# Altium schematic sheet P20_WIFI&BT_SDIO_IO EXPANDERS.SchDoc
size 420 x 297 mm
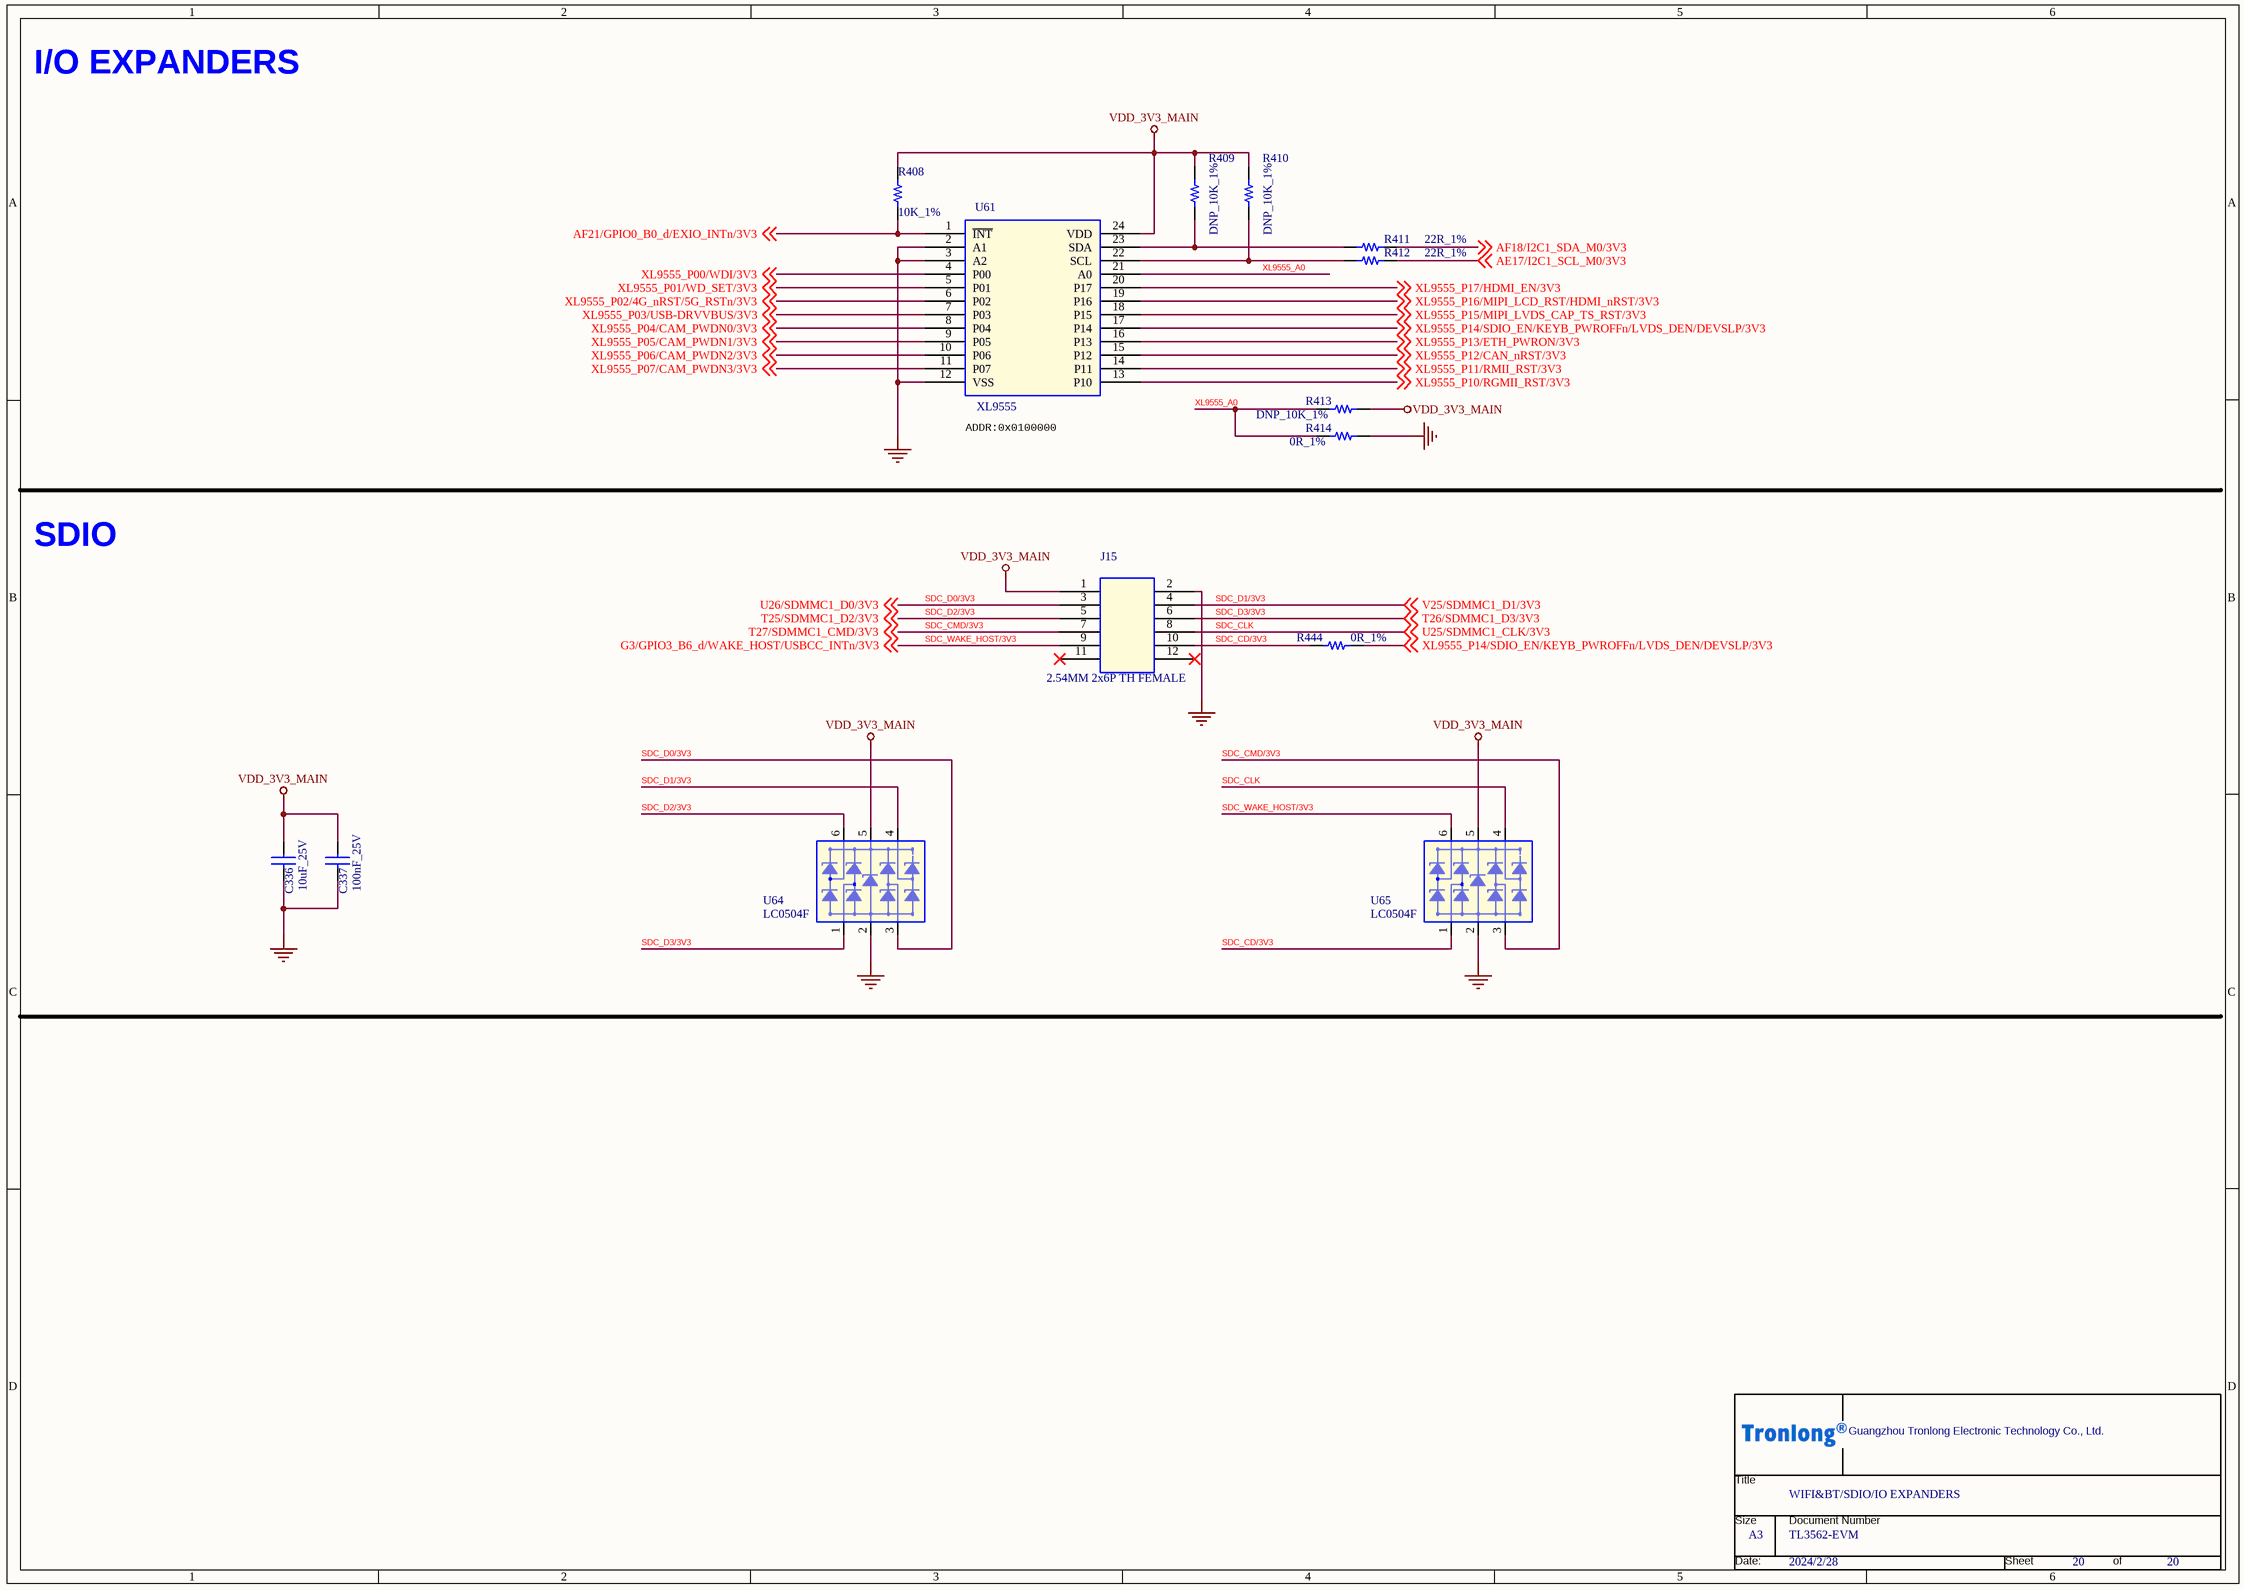
[diagram p0: P20_WIFI&BT_SDIO_IO EXPANDERS.SchDoc]

## Parts
*  Page Count: 20  Page Size: A3  OrgName: Guangzhou Tronlong Electronic Technology Co., Ltd.  Title: WIFI&BT/SDIO/IO EXPANDERS  Doc: TL3562-EVM  Page Modify Date: 2024/2/28  (hidden comment: Tronlong_TITTLE_20211115)  (graphical)
C336  10uF_25V  [C0603]
C337  100nF_25V  [C0402]
J15  2.54MM 2x6P TH FEMALE  [header_2x6_2d54_male]
R408  10K_1%  [R0402]
R409  DNP_10K_1%  [R0402]
R410  DNP_10K_1%  [R0402]
R411  22R_1%  [R0402]
R412  22R_1%  [R0402]
R413  DNP_10K_1%  [R0402]
R414  0R_1%  [R0603]
R444  0R_1%  [R0402]
U61  XL9555  [TSSOP24]
U64  LC0504F  [SOT363]
U65  LC0504F  [SOT363]

## Nets
GND: C336.2 C337.2 J15.2 R414.2 U61.2(A1) U61.3(A2) U61.12(VSS) U64.2 U65.2
VDD_3V3_MAIN: C336.1 C337.1 J15.1 R408.1 R409.1 R410.1 R413.1 U61.24(VDD) U64.5 U65.5
AE17/I2C1_SCL_M0/3V3: R412.1 ; off-sheet AE17/I2C1_SCL_M0/3V3
AF18/I2C1_SDA_M0/3V3: R411.1 ; off-sheet AF18/I2C1_SDA_M0/3V3
AF21/GPIO0_B0_d/EXIO_INTn/3V3: R408.2 U61.1(~{INT}) ; off-sheet AF21/GPIO0_B0_d/EXIO_INTn/3V3
SDC_CD/3V3: J15.10 R444.2 U65.1
SDC_CLK: J15.8 U65.4 ; off-sheet U25/SDMMC1_CLK/3V3  [also labelled U25/SDMMC1_CLK/3V3]
SDC_CMD/3V3: J15.7 U65.3 ; off-sheet T27/SDMMC1_CMD/3V3  [also labelled T27/SDMMC1_CMD/3V3]
SDC_D0/3V3: J15.3 U64.3 ; off-sheet U26/SDMMC1_D0/3V3  [also labelled U26/SDMMC1_D0/3V3]
SDC_D1/3V3: J15.4 U64.4 ; off-sheet V25/SDMMC1_D1/3V3  [also labelled V25/SDMMC1_D1/3V3]
SDC_D2/3V3: J15.5 U64.6 ; off-sheet T25/SDMMC1_D2/3V3  [also labelled T25/SDMMC1_D2/3V3]
SDC_D3/3V3: J15.6 U64.1 ; off-sheet T26/SDMMC1_D3/3V3  [also labelled T26/SDMMC1_D3/3V3]
SDC_WAKE_HOST/3V3: J15.9 U65.6 ; off-sheet G3/GPIO3_B6_d/WAKE_HOST/USBCC_INTn/3V3  [also labelled G3/GPIO3_B6_d/WAKE_HOST/USBCC_INTn/3V3]
XL9555_A0: R413.2 R414.1 U61.21(A0)
XL9555_P00/WDI/3V3: U61.4(P00) ; off-sheet XL9555_P00/WDI/3V3
XL9555_P01/WD_SET/3V3: U61.5(P01) ; off-sheet XL9555_P01/WD_SET/3V3
XL9555_P02/4G_nRST/5G_RSTn/3V3: U61.6(P02) ; off-sheet XL9555_P02/4G_nRST/5G_RSTn/3V3
XL9555_P03/USB-DRVVBUS/3V3: U61.7(P03) ; off-sheet XL9555_P03/USB-DRVVBUS/3V3
XL9555_P04/CAM_PWDN0/3V3: U61.8(P04) ; off-sheet XL9555_P04/CAM_PWDN0/3V3
XL9555_P05/CAM_PWDN1/3V3: U61.9(P05) ; off-sheet XL9555_P05/CAM_PWDN1/3V3
XL9555_P06/CAM_PWDN2/3V3: U61.10(P06) ; off-sheet XL9555_P06/CAM_PWDN2/3V3
XL9555_P07/CAM_PWDN3/3V3: U61.11(P07) ; off-sheet XL9555_P07/CAM_PWDN3/3V3
XL9555_P10/RGMII_RST/3V3: U61.13(P10) ; off-sheet XL9555_P10/RGMII_RST/3V3
XL9555_P11/RMII_RST/3V3: U61.14(P11) ; off-sheet XL9555_P11/RMII_RST/3V3
XL9555_P12/CAN_nRST/3V3: U61.15(P12) ; off-sheet XL9555_P12/CAN_nRST/3V3
XL9555_P13/ETH_PWRON/3V3: U61.16(P13) ; off-sheet XL9555_P13/ETH_PWRON/3V3
XL9555_P14/SDIO_EN/KEYB_PWROFFn/LVDS_DEN/DEVSLP/3V3: R444.1 U61.17(P14) ; off-sheet XL9555_P14/SDIO_EN/KEYB_PWROFFn/LVDS_DEN/DEVSLP/3V3
XL9555_P15/MIPI_LVDS_CAP_TS_RST/3V3: U61.18(P15) ; off-sheet XL9555_P15/MIPI_LVDS_CAP_TS_RST/3V3
XL9555_P16/MIPI_LCD_RST/HDMI_nRST/3V3: U61.19(P16) ; off-sheet XL9555_P16/MIPI_LCD_RST/HDMI_nRST/3V3
XL9555_P17/HDMI_EN/3V3: U61.20(P17) ; off-sheet XL9555_P17/HDMI_EN/3V3
NetR409_2: R409.2 R411.2 U61.23(SDA)
NetR410_2: R410.2 R412.2 U61.22(SCL)

Not connected (* = marked no-connect by the designer): J15 11* 12*

## Notes on the sheet
- I/O EXPANDERS
- (near U61) ADDR:0x0100000
- SDIO
- (in symbol Tronlong_TITTLE_20211115) Title; Size; Document Number; Date:; Sheet; of

## Library data of the parts
* = Tronlong_TITTLE_20211115: RevCode: A?; Page Number: 20; Page Create Date: March  8, 1995
C336 = CAP NP_Dup3: 贴片陶瓷电容,10uF,10%,10V,X5R; Manufacturer Character: 中国大陆; As-Welded: /; Operation Temperature（℃）: -55~85℃; PCB Footprint: C0603
C337 = CAP NP_Dup3: 贴片陶瓷电容,100nF,10%,25V,X5R; Manufacturer Character: 中国大陆; Operation Temperature（℃）: -55~85℃; As-Welded: /; PCB Footprint: C0402
J15 = CON12A: 排母,2X6PIN,间距2.54MM,180度,插件; Manufacturer: 深圳市长江连接器有限公司（CJT）; Manufacturer PartNumber: A2541HWV-2x6P; Manufacturer Character: 中国大陆; As-Welded: /; Temperature: -55~105℃; PCB Footprint: header_2x6_2d54_male
R408 = Resistor_Dup1: 贴片电阻,10K,±1%,1/16W; Manufacturer Character: 中国大陆; CLASS: DISCRETE; As-Welded: /; Operation Temperature（℃）: -55~155℃; PCB Footprint: R0402; Temperature: -55~155℃
R409 R410 R413 = Resistor_Dup1: 贴片电阻,10K,±1%,1/16W; Manufacturer Character: 中国大陆; CLASS: DISCRETE; Operation Temperature（℃）: -55~155℃; As-Welded: DNP; Temperature: -55~155℃; PCB Footprint: R0402
R411 = Resistor_Dup1: 贴片电阻,22R,±1%,1/16W; Manufacturer Character: 中国大陆; CLASS: DISCRETE; As-Welded: /; Operation Temperature（℃）: -55~155℃; Temperature: -55~155℃; PCB Footprint: R0402
R412 = Resistor_Dup1: 贴片电阻,22R,±1%,1/16W; Manufacturer Character: 中国大陆; CLASS: DISCRETE; Operation Temperature（℃）: -55~155℃; As-Welded: /; Temperature: -55~155℃; PCB Footprint: R0402
R414 = Resistor_Dup1: 贴片电阻,0R,±1%,1/10W; Manufacturer Character: 中国大陆; CLASS: DISCRETE; As-Welded: /; Operation Temperature（℃）: -55~155℃; PCB Footprint: R0603; Temperature: -55~155℃
R444 = Resistor_Dup3: 贴片电阻,0R,±1%,1/16W; Manufacturer Character: 中国大陆; CLASS: DISCRETE; Operation Temperature（℃）: -55~155℃; As-Welded: /; PCB Footprint: R0402
U61 = XL9555_0: 拓展IO芯片; Manufacturer: 信路达信息技术（厦门）有限公司（xinluda）; Manufacturer Character: 中国大陆; Operation Temperature（℃）: -40~85℃; As-Welded: /; PCB Footprint: TSSOP24; Manufacturer PartNumber: XL9555; Temperature: -40~85℃
U64 U65 = PRTR5V0U4Y_0: ESD二极管,VRWM=5V,VBR=6V,四组,单向,8KV,15KV; Manufacturer: 上海雷卯电子科技有限公司（Leiditech）; Manufacturer Character: 中国大陆; Operation Temperature（℃）: -55~125℃; room: SD; As-Welded: /; Manufacturer Part Number: PRTR5V0U4Y; Manufacturer PartNumber: LC0504F; Temperature: -40~85℃; PCB Footprint: SOT363